# EAGLE design Pure Quantiser (EAGLE 8.7.0)
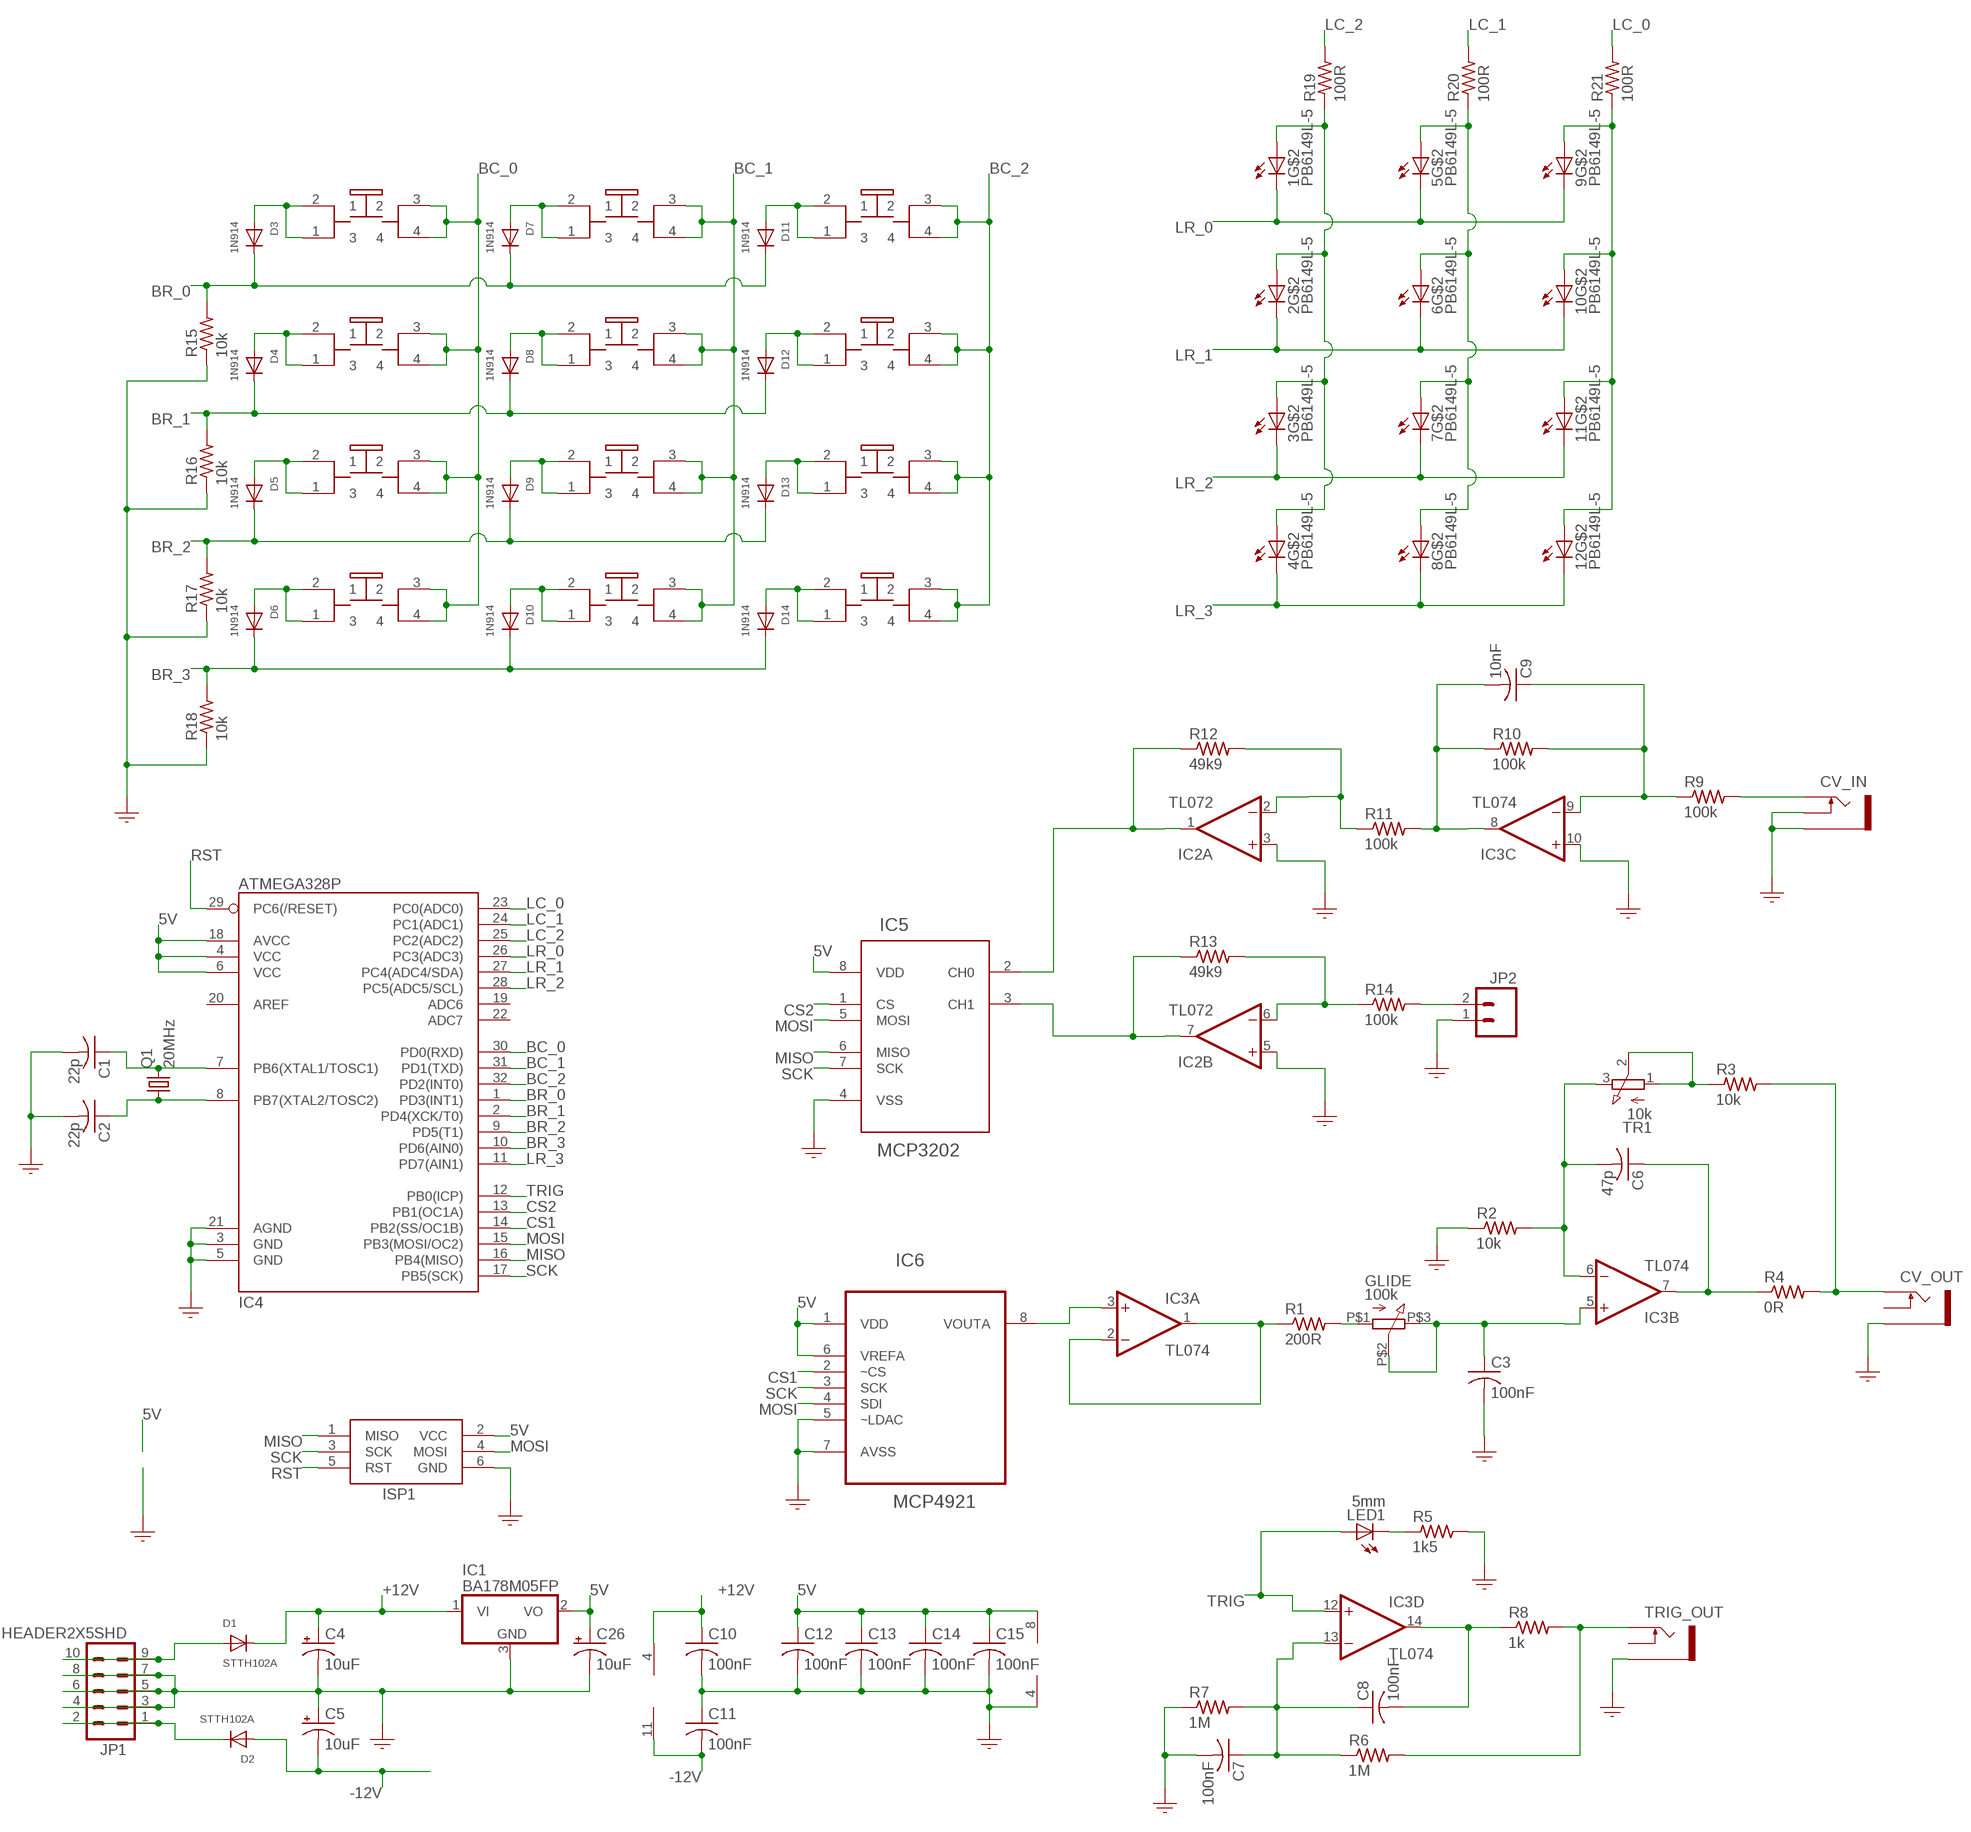
[diagram p0: schematic, sheet 1]

## Parts
1  PB6149L-5  SWITCH_PUSHBUTTON_LED  [PB6149L]
2  PB6149L-5  SWITCH_PUSHBUTTON_LED  [PB6149L]
3  PB6149L-5  SWITCH_PUSHBUTTON_LED  [PB6149L]
4  PB6149L-5  SWITCH_PUSHBUTTON_LED  [PB6149L]
5  PB6149L-5  SWITCH_PUSHBUTTON_LED  [PB6149L]
6  PB6149L-5  SWITCH_PUSHBUTTON_LED  [PB6149L]
7  PB6149L-5  SWITCH_PUSHBUTTON_LED  [PB6149L]
8  PB6149L-5  SWITCH_PUSHBUTTON_LED  [PB6149L]
9  PB6149L-5  SWITCH_PUSHBUTTON_LED  [PB6149L]
10  PB6149L-5  SWITCH_PUSHBUTTON_LED  [PB6149L]
11  PB6149L-5  SWITCH_PUSHBUTTON_LED  [PB6149L]
12  PB6149L-5  SWITCH_PUSHBUTTON_LED  [PB6149L]
C1  22p  CAPACITOR-USC0805  [C0805]
C2  22p  CAPACITOR-USC0805  [C0805]
C3  100nF  CAPACITOR-USC0805  [C0805]
C4  10uF  CAPACITOR_POL-US153CLV-0505  [153CLV-0505]
C5  10uF  CAPACITOR_POL-US153CLV-0505  [153CLV-0505]
C6  47p  CAPACITOR-USC0805  [C0805]
C7  100nF  CAPACITOR-USC0805  [C0805]
C8  100nF  CAPACITOR-USC0805  [C0805]
C9  10nF  CAPACITOR-USC0805  [C0805]
C10  100nF  CAPACITOR-USC0805  [C0805]
C11  100nF  CAPACITOR-USC0805  [C0805]
C12  100nF  CAPACITOR-USC0805  [C0805]
C13  100nF  CAPACITOR-USC0805  [C0805]
C14  100nF  CAPACITOR-USC0805  [C0805]
C15  100nF  CAPACITOR-USC0805  [C0805]
C26  10uF  CAPACITOR_POL-US153CLV-0505  [153CLV-0505]
CV_IN  PJ301M-12  SOCKET_MONO_3.5MMPJ301M-12  [PJ301M-12]
CV_OUT  PJ301M-12  SOCKET_MONO_3.5MMPJ301M-12  [PJ301M-12]
D1  STTH102A  DIODESMA  [SMADIODE]
D2  STTH102A  DIODESMA  [SMADIODE]
D3  1N914  DIODEDO-41  [DO-41]
D4  1N914  DIODEDO-41  [DO-41]
D5  1N914  DIODEDO-41  [DO-41]
D6  1N914  DIODEDO-41  [DO-41]
D7  1N914  DIODEDO-41  [DO-41]
D8  1N914  DIODEDO-41  [DO-41]
D9  1N914  DIODEDO-41  [DO-41]
D10  1N914  DIODEDO-41  [DO-41]
D11  1N914  DIODEDO-41  [DO-41]
D12  1N914  DIODEDO-41  [DO-41]
D13  1N914  DIODEDO-41  [DO-41]
D14  1N914  DIODEDO-41  [DO-41]
GLIDE  100k  RESISTOR_VARIABLE9MM_POT  [POTENTIOMETER_9MM]
IC1  BA178M05FP  VOLTAGE_REG_POS05DT  [TO252]
IC2  TL072  OPAMP_DUALD  [SO08]
IC3  TL074  OPAMP_QUADD  [SO14]
IC4  ATMEGA328P  MICROPROCESSOR_ATMEGA328_SMT  [TQFP32-08]
IC5  MCP3202  ADC_DUAL_12B_MCP3202  [SOIC--8]
IC6  MCP4921  DAC_SINGLE_12B_MCP4921  [SOIC8]
ISP1  HEADER2X3-6  [AVRISP]
JP1  HEADER2X5SHD  [2X5-SHROUDED]
JP2  HEADER1X2PTH  [1X02]
LED1  5mm  LED5MM  [LED5MM]
Q1  20MHz  CRYSTALHC49UP  [HC49UP]
R1  200R  RESISTOR_USR0805  [R0805]
R2  10k  RESISTOR_USR0805  [R0805]
R3  10k  RESISTOR_USR0805  [R0805]
R4  0R  RESISTOR_USR0805  [R0805]
R5  1k5  RESISTOR_USR0805  [R0805]
R6  1M  RESISTOR_USR0805  [R0805]
R7  1M  RESISTOR_USR0805  [R0805]
R8  1k  RESISTOR_USR0805  [R0805]
R9  100k  RESISTOR_USR0805  [R0805]
R10  100k  RESISTOR_USR0805  [R0805]
R11  100k  RESISTOR_USR0805  [R0805]
R12  49k9  RESISTOR_USR0805  [R0805]
R13  49k9  RESISTOR_USR0805  [R0805]
R14  100k  RESISTOR_USR0805  [R0805]
R15  10k  RESISTOR_USR0805  [R0805]
R16  10k  RESISTOR_USR0805  [R0805]
R17  10k  RESISTOR_USR0805  [R0805]
R18  10k  RESISTOR_USR0805  [R0805]
R19  100R  RESISTOR_USR0805  [R0805]
R20  100R  RESISTOR_USR0805  [R0805]
R21  100R  RESISTOR_USR0805  [R0805]
TR1  10k  RESISTOR_VARIABLETRIMMER_TH  [TRIMMER_TH]
TRIG_OUT  PJ301M-12  SOCKET_MONO_3.5MMPJ301M-12  [PJ301M-12]

## Nets
5V: C12.1 C13.1 C14.1 C15.1 C26.+ IC1.2(VO) IC2.8(P:V+) IC4.4(VCC) IC4.6(VCC) IC4.18(AVCC) IC5.8(VDD) IC6.1(VDD) IC6.6(VREFA) ISP1.2(VCC)
+12V: C4.+ C10.1 D1.C IC1.1(VI) IC3.4(P:V+)
-12V: C5.- C11.2 D2.A IC3.11(P:V-)
BC_0: 1.3 1.4 2.3 2.4 3.3 3.4 4.3 4.4 IC4.30(PD0(RXD))
BC_1: 5.3 5.4 6.3 6.4 7.3 7.4 8.3 8.4 IC4.31(PD1(TXD))
BC_2: 9.3 9.4 10.3 10.4 11.3 11.4 12.3 12.4 IC4.32(PD2(INT0))
BR_0: D3.C D7.C D11.C IC4.1(PD3(INT1)) R15.2
BR_1: D4.C D8.C D12.C IC4.2(PD4(XCK/T0)) R16.2
BR_2: D5.C D9.C D13.C IC4.9(PD5(T1)) R17.2
BR_3: D6.C D10.C D14.C IC4.10(PD6(AIN0)) R18.2
CS1: IC4.14(PB2(SS/OC1B)) IC6.2(~CS)
CS2: IC4.13(PB1(OC1A)) IC5.1(CS)
GND: C1.2 C2.2 C3.2 C4.- C5.+ C7.2 C10.2 C11.1 C12.2 C13.2 C14.2 C15.2 C26.- CV_IN.GND(SLEEVE) CV_IN.NORM(SWITCH) CV_OUT.GND(SLEEVE) IC1.3(GND) IC2.3(A:+IN) IC2.4(P:V-) IC2.5(B:+IN) IC3.10(C:+IN) IC4.3(GND) IC4.5(GND) IC4.21(AGND) IC5.4(VSS) IC6.5(~LDAC) IC6.7(AVSS) ISP1.6(GND) JP1.3 JP1.4 JP1.5 JP1.6 JP1.7 JP1.8 JP2.1 R2.1 R5.2 R7.1 R15.1 R16.1 R17.1 R18.1 TRIG_OUT.GND(SLEEVE)
LC_0: IC4.23(PC0(ADC0)) R21.2
LC_1: IC4.24(PC1(ADC1)) R20.2
LC_2: IC4.25(PC2(ADC2)) R19.2
LR_0: 1.K(C) 5.K(C) 9.K(C) IC4.26(PC3(ADC3))
LR_1: 2.K(C) 6.K(C) 10.K(C) IC4.27(PC4(ADC4/SDA))
LR_2: 3.K(C) 7.K(C) 11.K(C) IC4.28(PC5(ADC5/SCL))
LR_3: 4.K(C) 8.K(C) 12.K(C) IC4.11(PD7(AIN1))
MISO: IC4.16(PB4(MISO)) IC5.6(MISO) ISP1.1(MISO)
MOSI: IC4.15(PB3(MOSI/OC2)) IC5.5(MOSI) IC6.4(SDI) ISP1.4(MOSI)
N$1: C1.1 IC4.7(PB6(XTAL1/TOSC1)) Q1.2
N$2: C2.1 IC4.8(PB7(XTAL2/TOSC2)) Q1.1
N$3: IC3.3(A:+IN) IC6.8(VOUTA)
N$4: IC3.1(A:OUT) IC3.2(A:-IN) R1.1
N$5: GLIDE.P$1 R1.2
N$6: C3.1 GLIDE.P$2 GLIDE.P$3 IC3.5(B:+IN)
N$7: R3.1 TR1.1 TR1.2
N$8: CV_OUT.TIP R3.2 R4.2
N$9: D1.A JP1.9 JP1.10
N$10: D2.C JP1.1 JP1.2
N$11: C6.1 IC3.7(B:OUT) R4.1
N$12: C6.2 IC3.6(B:-IN) R2.2 TR1.3
N$13: C7.1 C8.1 IC3.13(D:-IN) R6.1 R7.2
N$14: LED1.K(C) R5.1
N$15: R6.2 R8.2 TRIG_OUT.TIP
N$16: C8.2 IC3.14(D:OUT) R8.1
N$17: C9.1 IC3.9(C:-IN) R9.1 R10.2
N$18: CV_IN.TIP R9.2
N$19: IC2.1(A:OUT) IC5.2(CH0) R12.1
N$20: IC2.2(A:-IN) R11.1 R12.2
N$21: C9.2 IC3.8(C:OUT) R10.1 R11.2
N$22: 1.1 1.2 D3.A
N$23: IC2.7(B:OUT) IC5.3(CH1) R13.1
N$24: IC2.6(B:-IN) R13.2 R14.1
N$25: JP2.2 R14.2
N$26: 2.1 2.2 D4.A
N$27: 3.1 3.2 D5.A
N$28: 4.1 4.2 D6.A
N$29: 5.1 5.2 D7.A
N$30: 6.1 6.2 D8.A
N$31: 7.1 7.2 D9.A
N$32: 8.1 8.2 D10.A
N$33: 9.1 9.2 D11.A
N$34: 10.1 10.2 D12.A
N$35: 11.1 11.2 D13.A
N$36: 12.1 12.2 D14.A
N$37: 1.A 2.A 3.A 4.A R19.1
N$38: 5.A 6.A 7.A 8.A R20.1
N$39: 9.A 10.A 11.A 12.A R21.1
RST: IC4.29(PC6(/RESET)) ISP1.5(RST)
SCK: IC4.17(PB5(SCK)) IC5.7(SCK) IC6.3(SCK) ISP1.3(SCK)
TRIG: IC3.12(D:+IN) IC4.12(PB0(ICP)) LED1.A
Unconnected: CV_OUT.NORM(SWITCH) IC4.19(ADC6) IC4.20(AREF) IC4.22(ADC7) TRIG_OUT.NORM(SWITCH)

## Library data of the parts
1-12 = GMSN:SWITCH_PUSHBUTTON_LED: Pushbutton LED; SORT: 9
C1-C3 C6-C15 = GMSN:CAPACITOR-US: Capacitor; SORT: 3
C4 C5 C26 = GMSN:CAPACITOR_POL-US: Electro Capacitor; SORT: 6
CV_IN CV_OUT TRIG_OUT = GMSN:SOCKET_MONO_3.5MM: 3.5 mm Jack Socket; SORT: 8
D1-D14 = GMSN:DIODE: Diode SMADIODE - SMA Surface Mount Package 20V 1A Schottky Diode Digikey: 641-1014-6-ND DO-1N4148 - Through Hole Small Current Diode SOD-123 20V 1 A (.5mV Vf) Schottky Diode - Digikey: MBRX120TPMSCT-ND SOD-323 10V 570mA (.38mV Vf, 3ns) Schottky Diode - Digikey: ZLLS410CT-ND SOD-523 30V 30mA Schottky Diode (RB751S-40TE61) - Digikey: RB751S-40TE61CT-ND SOT23-R/W - SOT23 Package (R = Solder Paste/Reflow Ovens, W = Hand-Soldering) BAT54Film 40V 300mA - Digikey: 497-7162-1-ND; SORT: 1
GLIDE = GMSN:RESISTOR_VARIABLE: Potentiometer; SORT: 8
IC1 = GMSN:VOLTAGE_REG_POS: Positive Voltage Regulator Added bigger pads to the TO-92 package; SORT: 4
IC2 = GMSN:OPAMP_DUAL: OP AMP; SORT: 4
IC3 = GMSN:OPAMP_QUAD: OP AMP; SORT: 4
IC4 = GMSN:MICROPROCESSOR_ATMEGA328_SMT: 32-Pin ATMEGA328 Commonly used on Arduino compatible boards Available in QFP and QFN packages TQFP is IC-09069 QFN is non-stock; SORT: 4
IC5 = GMSN:ADC_DUAL_12B_MCP3202: 12bit 2Ch ADC; SORT: 4
IC6 = GMSN:DAC_SINGLE_12B_MCP4921: 12bit DAC; SORT: 4
ISP1 = GMSN:HEADER2X3: AVR ISP Header Standard 6 pin header for AVR programming; SORT: 7
JP1 = GMSN:HEADER2X5: Header 5x2 Standard 10-pin dual row 0.1" header. Commonly used with AVR-ISP. Use with Spark Fun Electronics SKU: PRT-00778; SORT: 7
JP2 = GMSN:HEADER1X2: Header 1x2; SORT: 7
LED1 = GMSN:LED: LED OSRAM: - CHIPLED LG R971, LG N971, LY N971, LG Q971, LY Q971, LO R971, LY R971 LH N974, LH R974 LS Q976, LO Q976, LY Q976 LO Q996 - Hyper CHIPLED LW Q18S LB Q993, LB Q99A, LB R99A - SideLED LS A670, LO A670, LY A670, LG A670, LP A670 LB A673, LV A673, LT A673, LW A673 LH A674 LY A675 LS A676, LA A676, LO A676, LY A676, LW A676 LS A679, LY A679, LG A679 - Hyper Micro SIDELED® LS Y876, LA Y876, LO Y876, LY Y876 LT Y87S - SmartLED LW L88C, LW L88S LB L89C, LB L89S, LG L890 LS L89K, LO L89K, LY L89K LS L896, LA L896, LO L896, LY L896 - TOPLED LS T670, LO T670, LY T670, LG T670, LP T670 LSG T670, LSP T670, LSY T670, LOP T670, LYG T670 LG T671, LOG T671, LSG T671 LB T673, LV T673, LT T673, LW T673 LH T674 LS T676, LA T676, LO T676, LY T676, LB T676, LH T676, LSB T676, LW T676 LB T67C, LV T67C, LT T67C, LS T67K, LO T67K, LY T67K, LW E67C LS E67B, LA E67B, LO E67B, LY E67B, LB E67C, LV E67C, LT E67C LW T67C LS T679, LY T679, LG T679 LS T770, LO T770, LY T770, LG T770, LP T770 LB T773, LV T773, LT T773, LW T773 LH T774 LS E675, LA E675, LY E675, LS T675 LS T776, LA T776, LO T776, LY T776, LB T776 LHGB T686 LT T68C, LB T68C - Hyper Mini TOPLED® LB M676 - Mini TOPLED Santana® LG M470 LS M47K, LO M47K, LY M47K Source: http://www.osram.convergy.de/; SORT: 9
Q1 = GMSN:CRYSTAL: Crystal; SORT: 5
R1-R21 = GMSN:RESISTOR_US: Resistor; SORT: 2
TR1 = GMSN:RESISTOR_VARIABLE: Potentiometer; SORT: 7

## Board
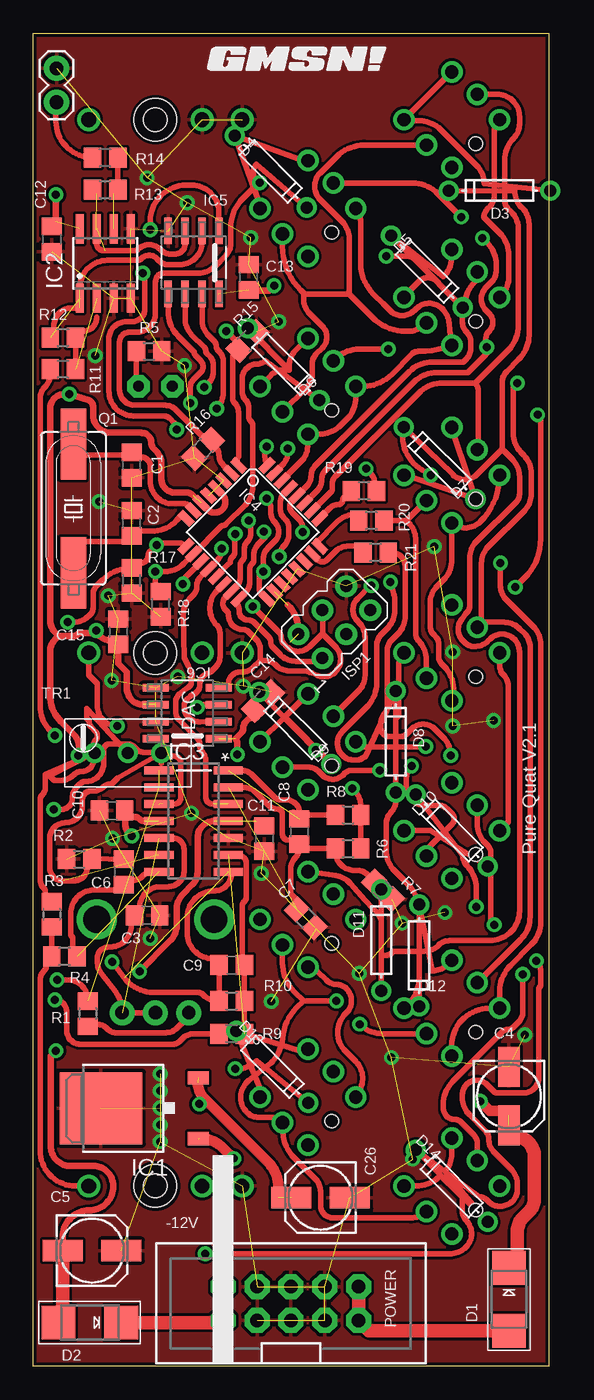
[diagram p1: board, top side]
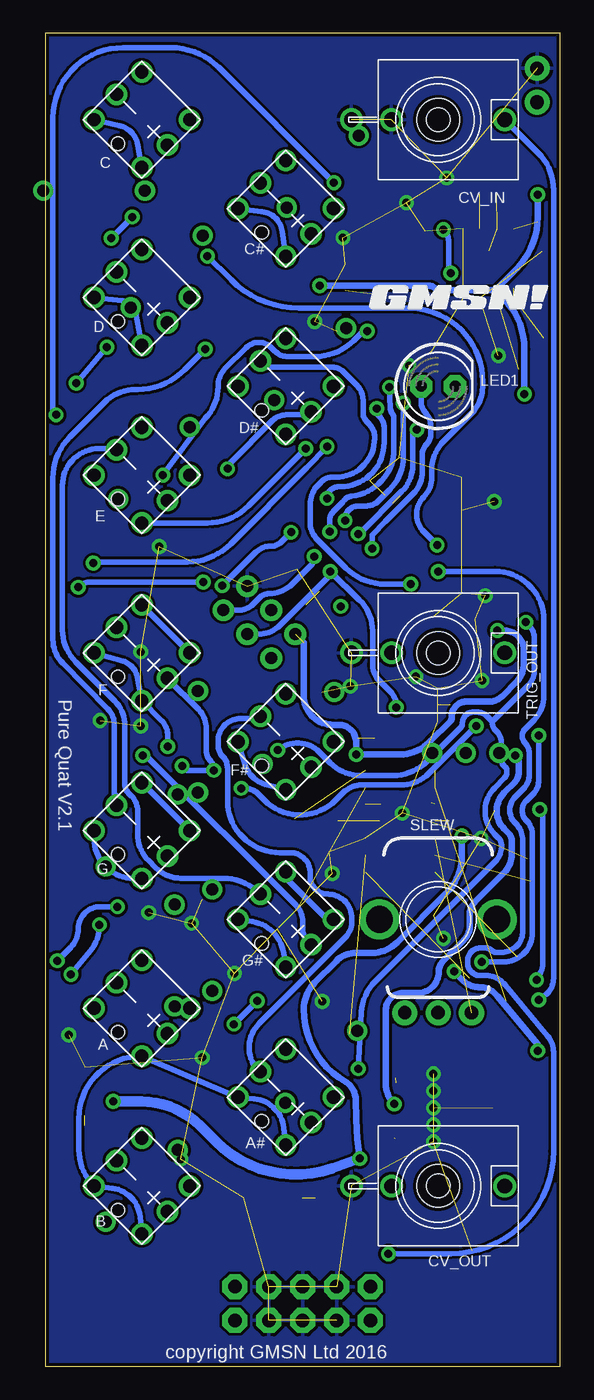
[diagram p2: board, bottom side, seen from below]

Size 38.64 x 100 mm. Coordinates in mm from the lower left corner, seen from the top.
Outline: 38.64,0 0,0 0,100 38.64,100 38.64,0
Copper layers (1*16): Top 0.035mm / dielectric 1.5mm / Bottom 0.035mm
Design rules "SparkFun": minimum track width 8mil, minimum drill 20mil, track to track 8mil, track to pad 8mil, pad to pad 8mil, via to via 8mil, smd to smd 8mil, copper to edge 10mil, drill to drill 8mil, minimum pad ring 12mil, minimum via ring 10mil, stop-mask expansion 4mil, vias tented up to drill 25mil, thermal gap 10mil
Holes 3.2 mm at 9.16,13.52 9.16,53.52 9.16,93.52

### Footprints (pad centres in the part's own frame; a part is rotated, then mirrored left to right if it is on the bottom)
PB6149L = drill 1: 1 2.54,-2.54; 2 2.54,2.54; 3 -2.54,-2.54; 4 -2.54,2.54; A 0,-2.7; K 0,2.7 | hole 1: -2.54,0
C0805 = smd 1.3 x 1.5: 1 -0.95,0; 2 0.95,0
153CLV-0505 = smd 3 x 1.6: + 2.2,0; - -2.2,0
PJ301M-12 = drill 1.1: GND 0,-6.5; NORM 0,-3.5; TIP 0,5 | hole 1.778: 0,0
SMADIODE = smd 2.54 x 2.54: A 2.349,0; C -2.349,0
DO-41 = drill 0.9: A -3.81,0; C 3.81,0
POTENTIOMETER_9MM = drill 1 pad 1.88: P$1 -2.5,-7; P$2 0,-7; P$3 2.5,-7 | drill 2 pad 2.68: P$4 -4.4,0; P$5 4.4,0
TO252 = smd 1 x 1.6: 1 -2.28,-4.8; 2 2.28,-4.8 | smd 5.4 x 6.2: 3 0,2.5
SO08 = smd 0.6 x 2.2: 1 -1.905,-2.6; 2 -0.635,-2.6; 3 0.635,-2.6; 4 1.905,-2.6; 5 1.905,2.6; 6 0.635,2.6; 7 -0.635,2.6; 8 -1.905,2.6
SO14 = smd 0.6 x 2.2: 1 -3.81,-2.6; 2 -2.54,-2.6; 3 -1.27,-2.6; 4 0,-2.6; 5 1.27,-2.6; 6 2.54,-2.6; 7 3.81,-2.6; 8 3.81,2.6; 9 2.54,2.6; 10 1.27,2.6; 11 0,2.6; 12 -1.27,2.6; 13 -2.54,2.6; 14 -3.81,2.6
TQFP32-08 = smd 1.27 x 0.559: 1 -4.293,2.8; 2 -4.293,2; 3 -4.293,1.2; 4 -4.293,0.4; 5 -4.293,-0.4; 6 -4.293,-1.2; 7 -4.293,-2; 8 -4.293,-2.8; 17 4.293,-2.8; 18 4.293,-2; 19 4.293,-1.2; 20 4.293,-0.4; 21 4.293,0.4; 22 4.293,1.2; 23 4.293,2; 24 4.293,2.8 | smd 0.559 x 1.27: 9 -2.8,-4.293; 10 -2,-4.293; 11 -1.2,-4.293; 12 -0.4,-4.293; 13 0.4,-4.293; 14 1.2,-4.293; 15 2,-4.293; 16 2.8,-4.293; 25 2.8,4.293; 26 2,4.293; 27 1.2,4.293; 28 0.4,4.293; 29 -0.4,4.293; 30 -1.2,4.293; 31 -2,4.293; 32 -2.8,4.293
SOIC--8 = smd 1.981 x 0.559: 1 -2.362,1.905; 2 -2.362,0.635; 3 -2.362,-0.635; 4 -2.362,-1.905; 5 2.362,-1.905; 6 2.362,-0.635; 7 2.362,0.635; 8 2.362,1.905
SOIC8 = smd 1.981 x 0.559: 1 -2.362,1.905; 2 -2.362,0.635; 3 -2.362,-0.635; 4 -2.362,-1.905; 5 2.362,-1.905; 6 2.362,-0.635; 7 2.362,0.635; 8 2.362,1.905
AVRISP = drill 0.9 pad 1.626: 1 -1.27,2.54; 2 1.27,2.54; 3 -1.27,0; 4 1.27,0; 5 -1.27,-2.54; 6 1.27,-2.54
2X5-SHROUDED = drill 1.016 pad 1.88 octagon: 1 -1.27,5.08; 2 1.27,5.08; 3 -1.27,2.54; 4 1.27,2.54; 5 -1.27,0; 6 1.27,0; 7 -1.27,-2.54; 8 1.27,-2.54; 9 -1.27,-5.08; 10 1.27,-5.08
1X02 = drill 1.016 pad 1.88: 1 0,0; 2 2.54,0
LED5MM = drill 0.813 pad 1.676 octagon: A -1.27,0; K 1.27,0
HC49UP = smd 5.334 x 1.93: 1 -4.826,0; 2 4.826,0
R0805 = smd 1.3 x 1.5: 1 -0.95,0; 2 0.95,0
TRIMMER_TH = drill 0.9: 1 -0.802,1.143; 2 -3.302,1.143; 3 -5.802,1.143

### Placement (x,y rotation side)
1  31.38,93.52 45 bottom
2  20.59,86.85 45 bottom
3  31.38,80.19 45 bottom
4  20.59,73.52 45 bottom
5  31.38,66.85 45 bottom
6  31.38,53.52 45 bottom
7  20.59,46.85 45 bottom
8  31.38,40.19 45 bottom
9  20.59,33.52 45 bottom
10  31.38,26.85 45 bottom
11  20.59,20.19 45 bottom
12  31.38,13.52 45 bottom
C1  7.37,67.61 270 top
C2  7.37,63.24 90 top
C3  8.53,33.83 0 top
C4  35.67,20.26 270 top
C5  4.4,8.67 0 top
C6  6.78,37.09 90 top
C7  20.43,33.59 315 top
C8  19.95,40.1 90 top
C9  14.88,30.1 180 top
C10  5.91,41.69 180 top
C11  17.34,39.59 90 top
C12  1.38,84.55 270 top
C13  16.14,81.69 90 top
C14  17.22,49.91 45 top
C15  6.38,55.1 90 top
C26  21.54,12.64 180 top
CV_IN  9.16,93.52 270 bottom
CV_OUT  9.16,13.52 270 bottom
D1  35.67,5.02 270 top
D2  4.24,3.27 180 top
D3  34.96,88.21 180 top
D4  17.81,89.63 315 top
D5  29.52,82.13 315 top
D6  18.76,75.19 315 top
D7  30.47,67.76 135 top
D8  27.18,46.85 90 top
D9  19.64,47.89 135 top
D10  31.38,40.19 135 top
D11  26.09,31.95 90 top
D12  28.93,30.82 270 top
D13  17.93,22.45 315 top
D14  31.38,13.52 135 top
GLIDE  9.16,33.52 0 bottom
IC1  7.57,19.35 90 top
IC2  5.39,82.73 0 top
IC3  12.02,40.9 270 top
IC4  16.46,62.57 315 top
IC5  12.02,82.81 270 top
IC6  11.54,48.99 180 top
ISP1  22.57,55.82 135 top
JP1  19.32,4.7 90 top
JP2  1.74,97.37 270 top
LED1  9.16,73.52 0 bottom
Q1  3.01,64.35 90 top
R1  4.08,26.45 270 top
R2  3.45,38.04 0 top
R3  1.38,33.91 270 top
R4  2.33,30.74 180 top
R5  8.68,76.14 0 top
R6  23.61,38.83 0 top
R7  26.23,35.7 135 top
R8  23.61,41.37 0 top
R9  14.88,24.94 180 top
R10  14.88,27.4 0 top
R11  2.21,74.79 180 top
R12  2.21,77.17 0 top
R13  5.39,88.28 0 top
R14  5.39,90.66 180 top
R15  16.07,76.93 225 top
R16  12.73,68.84 45 top
R17  7.37,58.95 90 top
R18  9.56,57.17 90 top
R19  24.8,65.66 180 top
R20  25.35,63.44 180 top
R21  25.67,61.06 180 top
TR1  3.79,47.15 180 top
TRIG_OUT  9.16,53.52 270 bottom
U$1  [GMSN!_LOGO]  7.33,80.11 0 bottom
U$2  [GMSN!_LOGO]  20.03,98.01 0 top

### Tracks (layer width: path | path; a pad name or v marks a point on that pad's centre or on a via)
5V  (via drill 0.6)  (9 unrouted)
  Top 0.5: IC4.6 13.07,64.26 arc45 13.61,64.03 arc90 14.4,64.82 arc45 14.14,65.44 IC4.4 | 19.08,57.12 arc-45 19.88,55.18 ISP1.2 | C14.1 16.75,48.67 16.59,48.67 arc90 15.75,47.84 arc-45 15.61,47.5 15.19,47.09 15.23,47 arc-22 15.31,46.59 v15.31,45.9 | 8.25,49.63 arc-90 7.02,50.86 7.02,52.09 6.35,52.71 C15.1 5.98,54.43 5.96,54.43 arc-45 4.79,54.91 4.67,55.02 | C13.1 16.78,80.69 | 16.78,80.69 17.68,80.69 v18.05,81.06 | v1.7,87.89 1.7,85.87 C12.1 1.61,85.33 | 16.53,80.44 16.78,80.69 | 12,65.33 arc45 11.49,65.54 10.64,65.54 arc-90 9.6,66.59 9.6,67.71 arc45 9.2,68.68 9.03,68.85 arc-45 8.84,69.3 arc90 8.11,70.03 5.87,70.03 arc-90 4.48,71.42 4.48,72.02 arc73 4.14,72.47 v2.69,72.92 2.33,72.92 arc90 1.26,71.86 1.26,55.97 arc45 1.65,55.03 1.9,54.79 | 1.9,54.79 3.02,54.79 arc45 3.34,54.92 arc-45 3.6,55.02 4.67,55.02 | 1.9,54.79 1.66,54.55 arc45 1.26,53.59 1.26,50.33 arc45 2.09,48.32 3.05,47.36 arc-45 3.45,46.42 3.45,45.86 v3.37,45.82 | v4.71,55.18 4.67,55.02 | v12.45,19.66 12.77,19.98 12.81,20.1
  Top 0.8: 12.33,21.25 arc45 12.81,20.1 17.6,15.31 arc-45 18.37,13.46 18.37,12.64
  Bottom 0.5: v18.05,81.06 9.85,81.06 arc45 9.35,80.85 arc-45 9.08,80.74 4.87,80.74 | v2.69,72.92 2.69,76.3 arc-45 4.29,80.16 4.87,80.74 | v1.7,87.89 1.7,86.19 arc45 3.3,82.31 4.87,80.74 | v3.37,45.82 3.13,45.38 3.13,44.54 arc45 3.43,43.81 4.21,43.03 arc-90 4.21,40.31 3.89,39.99 arc45 3.64,39.4 3.64,38.4 arc45 4.21,37.04 6.39,34.85 arc-45 6.78,33.92 6.78,33.13 arc45 7.29,31.89 8.77,30.41 arc-45 9.12,29.57 arc90 10.69,28 11.79,28 arc-90 13.09,26.7 13.09,21.2 arc-45 v12.45,19.66 | v4.71,55.18 4.2,55.18 arc90 2.73,53.71 2.73,52.7 arc45 3.3,51.32 4.33,50.29 arc45 5.35,49.87 7.05,49.87 arc-90 8.13,48.79 8.13,48.66 arc45 8.23,48.41 9.82,46.82 arc45 12.06,45.9 v15.31,45.9 15.31,46.82 arc-90 16.61,48.12 17.05,48.12 arc90 19.24,50.31 19.24,54.28
+12V  (via drill 0.6)  (3 unrouted)
  Top 0.4: 35.67,18.83 35.35,19.15
  Top 0.5: 8.33,40.9 arc-45 7.99,41.04 arc45 7.56,41.21 7.38,41.21 C10.1 6.91,40.6 arc60 v7.37,39.78
  Top 0.8: 35.35,19.15 34.24,19.15 v33.53,19.86 | v15.03,15.58 14.25,16.36 arc45 12.45,17.11
  Top 1.016: D1.C 35.72,7.37 36.31,7.96 36.31,10.14 arc-45 36.73,11.15 37.2,11.62 arc45 37.58,12.54 37.58,15.74 arc90 36.08,17.24 35.75,17.24 35.75,17.98 C4.+
  Bottom 0.5: v7.37,39.78 7.37,38.35 arc45 8.57,35.45 12.24,31.79 arc45 14.1,31.01 15.29,31.01 arc-45 16.82,30.38 18.4,28.8 arc-45 19.24,26.76 arc-60 16.11,21.33 arc60 15.35,20.02 arc-8 v15.03,15.58
  Bottom 0.8: v33.53,19.86 31.44,19.86 arc45 27.01,18.03 25.84,16.86 arc-64 17.11,14.86 v15.03,15.58
-12V  (via drill 0.6)  (2 unrouted)
  Top 0.5: C5.- 2.2,9.7 arc-90 4.19,11.69 arc90 5.99,13.48 5.99,13.54 arc90 4.51,15.02 2.79,15.02 arc-90 1.3,16.51 1.3,23.28 v1.7,23.67 | v7.97,29.62 10.27,31.93 arc45 10.75,33.08 10.75,34.25 arc-45 11.24,35.43 11.9,36.09 arc45 12.34,37.15 12.34,39.68 arc-90 13.55,40.9 | 16.7,40.9 17.34,40.26 C11.2
  Top 1.016: D2.A 2.2,3.58 C5.-
  Bottom 0.5: v1.7,23.67 1.7,24.15 4.72,27.79 arc-50 6.1,28.43 arc45 7.26,28.92 v7.97,29.62
BC_0
  Top 0.4: 26.23,79.71 26.75,79.18 arc90 28.56,79.18 28.72,79.34 arc-82 30.51,79.47 arc-49 31.19,78.24 arc5 3.3 arc-21 28.87,76.14 arc45 28.42,75.95 26.88,74.41 arc-45 24.73,73.52 4.4 24.18,72.7 arc-45 23.49,71.02 23.06,70.59 arc-45 21.46,69.93 4.3 20.59,69.14 arc-45 20.06,67.86 IC4.30 | 34.98,85.01 33.8,86.19 arc-45 34.06,86.83 34.27,87.04 arc45 34.56,87.74 34.56,92.51 arc-45 1.4
  Top 0.406: 34.98,85.01 arc-45 35.67,83.33 35.67,81.77 arc-45 35.04,80.25 3.4 | 26.23,79.71 25.5,80.44 arc-45 24.56,82.7 24.56,85.77 arc45 24.18,86.67 2.4
  Bottom 0.4: 1.3 31.69,91.62 arc-67 33.08,93.08 1.4 | 2.3 20.84,85.1 arc-75 22.38,86.63 2.4 | 3.4 32.85,79.93 arc72 31.86,79.01 3.3
BC_1  (via drill 0.6)
  Top 0.4: IC4.31 18.68,67.61 arc54 v19.08,68.84 | 34.88,53.52 6.4 34.98,52.56 arc45 35.27,51.85 arc-45 35.63,50.98 35.63,40.84 8.4 | 7.4 arc45 25.15,46.45 29.4,46.45 v29.44,46.49 | 33.54,63.37 arc-84 5.3 31.38,60.5 arc-45 30.77,59.01 30.3,58.54 arc45 29.76,57.23 29.76,55.56 arc45 30.05,54.85 30.21,54.69 arc-45 30.39,54.26 30.39,53.28 arc45 30.65,52.67 30.8,52.52 arc-64 6.3
  Top 0.406: 33.54,63.37 arc45 34.96,66.8 34.96,66.83 5.4
  Bottom 0.4: v19.08,68.84 23.36,64.55 arc45 26.48,63.26 5.3 | 6.4 32.82,52.91 arc63 31.72,51.71 6.3 29.91,48.45 arc45 29.44,47.32 v29.44,46.49 | 7.3 22.11,43.66 arc58 23.61,45.07 7.4 | 8.3 31.95,36.59 arc90 34.98,39.62 8.4
BC_2  (via drill 0.6)
  Top 0.4: 10.4 34.19,26.85 arc90 31.38,24.05 10.3 | 9.3 arc-45 21.29,29.64 21.96,28.97 arc45 22.77,28.63 arc-45 23.45,28.35 23.48,28.32 arc-90 23.48,26.51 23.42,26.45 arc90 23.42,23.62 24.18,22.86 arc-90 24.18,20.36 11.4
  Top 0.406: IC4.32 17.45,67.79 arc-40 v17.49,68.99 | 10.4 34.98,28.13 arc-45 35.77,30.04 37.36,31.63 arc45 38.05,33.3 38.05,54.16 arc45 37.5,55.5 35.41,57.59 arc-45 35.04,58.49 v35.04,60.26
  Bottom 0.4: 9.3 20.75,31.01 arc-73 23.1,33.35 9.4 | 11.3 20.73,17.87 arc-78 22.94,20.06 11.4 10.3 31.45,23.26 arc-90 36.11,18.6 36.11,16.25 arc-45 12.4 33.62,13.35 arc77 31.51,11.2 12.3
  Bottom 0.406: v17.49,68.99 19,67.41 24.73,61.68 arc45 27.96,60.34 34.96,60.34 v35.04,60.26
BR_0  (via drill 0.6)
  Top 0.4: D3.C 36.11,88.14 arc45 36.6,86.96 36.69,86.87 arc-45 37.18,85.69 37.18,77.37 arc-45 36.42,75.54 35.49,74.61 arc45 35.16,73.8 35.16,68.8 | IC4.1 15.11,67.88 15.31,68 15.39,68.24 15.39,71.55 arc45 15.09,72.27 15.09,72.27 arc-45 14.95,72.6 14.95,75.82 | 35.16,68.8 35.94,68.01 arc-45 36.47,66.74 36.47,65.42 | 36.47,36.77 36.47,53.57 arc45 36.05,54.56 arc90 34.26,54.56 34.13,54.44 arc-45 33.06,53.99 arc-45 32.37,54.28 32.24,54.4 arc-90 32.2,56.12 arc-15 32.54,56.57 arc44 32.73,57.05 32.73,60.68 | v29.8,66.85 29.9,66.95 arc-90 D7.C 31.41,66.95 31.48,66.87 arc90 33.23,66.87 35.16,68.8 | 28.7,31.13 27.15,31.13 arc45 26.93,31.04 26.89,31.01 arc-45 26.43,30.82 26.11,30.82 D11.C
  Top 0.406: 32.73,60.68 arc-45 33.22,61.86 36.24,64.88 arc45 36.47,65.42 | v14.48,77.65 15.39,76.73 R15.2 14.95,75.82 | 28.7,31.13 29.3,31.13 arc45 30.42,31.6 arc-45 31.22,31.93 34.23,31.93 arc90 36.47,34.17 36.47,36.77
  Bottom 0.406: v14.48,77.65 14.8,77.65 15.48,76.96 arc45 18.43,75.74 20.4,75.74 arc45 21.4,76.16 21.66,76.42 arc-90 23.57,76.42 25.11,74.87 arc-45 25.67,73.53 25.67,73.47 arc45 26.64,71.12 v29.8,66.85
BR_1  (via drill 0.6)
  Top 0.4: R16.2 13.09,69.28 | R16.2 13.28,69.63 12.81,69.63 10.67,71.77 arc45 9.9,72.09 7.62,72.09 arc-90 6.46,73.25 6.46,76.84 arc-90 7.19,77.57 7.7,77.57 arc90 9.16,79.03 9.16,81.35 arc-90 9.82,82.01 12.37,82.01 arc45 13.66,82.55 14.41,83.29 arc45 14.8,84.23 14.8,85.42 arc-45 15.7,87.6 16.9,88.8 v16.98,88.8 16.94,88.8 16.73,89 arc-90 16.73,90.18 D4.C | IC4.2 14.26,67.6 arc-45 13.92,68.4 13.92,68.41 arc45 13.73,68.87 13.4,69.2 R16.2 | D8.C 24.88,45.7 arc45 24.67,45.61 arc-45 24.4,45.5 23.87,45.5 arc-45 23.28,45.74 23.17,45.86 arc-90 23.17,47.6 24.98,49.41 arc45 25.75,51.27 25.75,54.04 arc-45 26.11,54.91 26.53,55.33 arc45 27.1,56.7 27.1,57.53 arc45 26.63,58.67 arc-135 26.69,58.83 v26.78,58.83 | v37.81,71.38 arc-45 38.05,70.8 38.05,62.06 arc-45 36.84,59.13 v36.15,58.44
  Top 0.406: D8.C 27.18,42.33 arc-45 26.89,41.64 26.88,41.63 arc45 26.46,40.62 26.46,38.69 arc45 27.09,37.17 28.04,36.22 arc-45 28.93,34.08 D12.C
  Bottom 0.4: v16.98,88.8 25.62,97.44 arc-45 29.19,98.92 32.8,98.92 arc-90 38.05,93.66 38.05,71.61 v37.81,71.38 | v36.15,58.44 arc45 35.19,58.83 v26.78,58.83
BR_2  (via drill 0.6)
  Top 0.4: v2.57,55.82 3.03,55.82 arc45 4.15,56.28 4.3,56.44 arc45 4.48,56.86 4.48,57.92 arc-45 4.73,58.54 5.17,58.97 arc-45 7.34,59.87 R17.2 7.53,59.9 7.89,60.26 8.08,60.26 arc90 8.6,60.79 arc-45 8.74,61.11 v9.24,61.61 arc-45 9.62,61.77 10.82,61.77 arc-45 IC4.9 | D9.C v21.18,46.21 | D13.C 16.76,22.9 arc-45 15.36,22.32 v15.15,22.32
  Top 0.406: D5.C 28.61,83.04 arc45 28.03,83.28 v26.46,83.28
  Bottom 0.4: 5.11,48.36 5.4,48.69 arc-48 6.26,49.07 6.54,49.07 arc-90 7.33,48.28 arc45 7.5,47.87 10,45.37 arc45 12.56,44.31 14.97,44.31 arc45 17.25,45.25 18.07,46.07 arc-85 v21.18,46.21 | 5.11,48.36 2.46,51.01 arc-45 1.94,52.27 1.94,54.53 arc-45 2.4,55.64 v2.57,55.82 | v26.46,83.28 24.69,81.51 arc-45 19.58,79.39 11.45,79.39 arc45 7.41,77.72 arc45 5.83,73.9 5.83,73.47 | 5.11,48.36 arc-45 4.83,47.68 4.73,47.58 arc45 4.44,46.88 4.44,45.58 arc-45 4.21,45.04 4.11,44.94 arc45 4,44.67 4,44.57 arc45 4.19,44.12 4.92,43.39 arc-90 4.92,39.91 4.64,39.63 arc45 4.4,39.04 arc45 4.88,37.87 13.87,28.88 arc-42 14.91,26.56 v15.15,22.32
  Bottom 0.406: 5.83,73.47 arc45 6.63,71.52 8.75,69.4 arc-45 9.64,67.27 9.64,66.68 arc45 10.24,65.21 arc-90 10.24,62.62 v9.24,61.61
BR_3  (via drill 0.6)
  Top 0.4: D6.C 17.4,75.45 arc-45 16.77,75.19 arc90 15.67,74.09 15.67,73.14 arc45 15.96,72.44 arc-45 16.14,71.99 16.14,71.33 arc45 16.34,70.86 arc-45 16.46,70.57 16.46,66.02 arc-45 15.88,64.6 14.44,63.16 arc-45 14.24,63.08 arc45 14.08,63.02 IC4.10 11.27,60.2 arc-45 9.89,59.63 v9.16,59.63 9.16,58.52 R18.2 | v12.89,8.43 31.22,8.43 arc45 32.45,8.94 arc90 32.45,10.94 arc-45 32.18,11.59 32.18,12.69 D14.C | 34.16,17.08 arc45 33.94,17.63 32.72,18.84 arc-45 32.18,20.16 32.18,20.34 arc-45 32.51,21.15 arc-90 33.99,21.15 34.52,20.62 arc45 34.81,20.5 36.76,20.5 arc90 37.89,21.63 37.89,28.24
  Top 0.406: D14.C 33.45,12.71 arc-45 34.01,12.47 34.16,12.32 arc45 34.93,12 35.04,12 arc90 36.31,13.27 36.31,13.6 arc45 35.8,14.81 34.57,16.04 arc-45 34.16,17.02 34.16,17.08 | 37.89,28.24 arc-45 37.98,28.44 arc45 38.05,28.62 38.05,29.65 arc45 v37.73,30.42 | v33.21,34.47 33.21,35.89 arc45 32.53,37.53 arc-45 32.2,38.33 D10.C
  Bottom 0.4: v9.16,59.63 4.9,59.63 arc90 1.22,55.95 1.22,50.27 arc45 1.96,48.49 2.63,47.82 arc-90 2.63,46.75 arc45 2.33,46.03 2.33,44.34 arc45 2.75,43.34 3.4,42.68 arc-90 3.4,40.78 3.35,40.72 arc45 2.81,39.42 2.81,32.65 arc90 4.41,31.05 4.82,31.05 arc45 5.19,31.21 arc-45 5.58,31.37 6.01,31.37 arc-90 6.94,30.44 6.94,30.18 arc-45 6.71,29.64 6.62,29.55 arc-45 6.04,29.31 5.62,29.31 arc50 4.14,28.61 0.94,24.75 arc40 0.51,23.55 0.51,16.15 arc90 8.23,8.43 v12.89,8.43
  Bottom 0.406: v37.73,30.42 36.73,31.42 arc-45 36.15,32.83 arc90 34.51,34.47 v33.21,34.47
CS1
  Top 0.4: 13.29,52.09 12.96,51.94 arc51 12.52,51.39 12.51,51.34 arc14 12.49,51.24 12.49,51.12 arc-35 12.36,50.71 12.29,50.6 arc-31 12.1,50.45 11.94,50.38 arc19 11.79,50.28 11.55,50.06 arc47 11.3,49.48 arc45 11.62,48.71 arc43 12.5,48.33
  Top 0.406: IC4.14 13.78,58.18 arc90 13.78,55.57 arc-45 14,55.02 14,53.21 arc-45 13.71,52.51 13.29,52.09 | 12.5,48.33 IC6.2
CS2  (via drill 0.6)
  Top 0.4: v10.75,70.27 arc45 10.52,70.81 10.25,71.08 arc45 9.72,71.3 7.52,71.3 arc-90 5.67,73.15 5.67,77.07 arc-90 6.96,78.36 7.4,78.36 arc90 8.37,79.33 8.37,82.01 v8.21,82.01 | v8.76,85.27 8.76,85.91 arc-90 11.45,88.6 11.87,88.6 arc-90 13.92,86.55 IC5.1 | IC4.13 14.74,60.28 arc45 14.76,60.32 arc-45 14.91,60.7 14.97,60.75 arc45 15.11,61.11 15.11,62.41 v15.15,62.45
  Bottom 0.4: v10.75,70.27 11.06,69.95 11.06,67.61 arc45 11.88,65.64 15.07,62.45 v15.15,62.45 | v8.21,82.01 8.37,82.01 8.37,84.31 arc-45 v8.76,85.27
GND  (via drill 0.6)  (73 unrouted)
  Top 0.5: C7.2 21.23,32.8
  other vias: 28.45,15.54 36.86,24.86 9.52,19.39 9.52,20.66 9.52,21.93 9.52,18.12 9.52,16.85 17.85,27.36 8.76,32.09 27.65,33.24 24.44,29.47 17.1,36.97 30.87,34.03 5.95,39.59 11.86,41.49 5.87,51.45 10.83,51.73 5.63,57.8 4.95,64.87 4.64,75.82 11.34,75.07 16.3,84.67 18.41,78.36 15.75,51.02 34.52,48.44 31.46,48.04 31.46,53.6 30.08,61.49 11.54,87.29 8.53,89.16 26.86,23.16
  pour Top: 38.64,100 0,100 0,0 38.64,0
  pour Bottom: 38.64,100 0,100 0,0 38.64,0
LC_0
  Top 0.4: IC4.23 21.39,60.46 arc90 21.98,60.46 22.61,61.09 arc-45 23.68,61.53 24.32,61.53 24.72,61.13 R21.2
LC_1
  Top 0.4: IC4.24 21.23,61.77 22.81,63.35 arc-45 24.16,63.91 24.4,63.67 R20.2
LC_2
  Top 0.4: IC4.25 22.24,64.38 arc-45 22.84,64.63 arc90 23.21,65 arc-45 23.28,65.18 23.61,65.5 R19.2
LR_0
  Top 0.4: IC4.26 22.34,65.61 | 1.K 34.77,95.43 arc-90 36.47,93.73 36.47,93.19 arc-45 36.03,92.13 arc45 35.35,90.51 35.35,87.48 arc45 35.63,86.82 35.84,86.6 arc-45 36.39,85.29 36.39,78.06 arc-45 35.65,76.27 33.37,74 | 33.37,72.09 33.37,68.84 5.K
  Top 0.406: 22.34,65.61 arc45 22.42,65.8 22.42,66.16 arc-45 22.68,66.8 28.9,73.02 arc-45 30.69,73.76 33.13,73.76 | 33.37,74 33.13,73.76 | 33.37,72.09 33.37,73.18 arc45 33.13,73.76
  Bottom 0.4: 5.K 33.37,68.84 34.59,68.84 arc-90 37.34,66.08 37.34,55.25 arc-45 36.34,52.84 33.41,49.9 arc45 32.66,48.09 32.66,43.64 arc-45 32.4,43.02 32.17,42.79 arc45 31.7,41.66 31.7,39.92 arc-45 30.88,37.93 30.33,37.38 arc-45 28.48,36.61 25.34,36.61 arc45 9.K
LR_1  (via drill 0.6)
  Top 0.4: 10.K 36.54,32.01 arc45 37.26,33.74 37.26,53.96 arc45 36.85,54.96 36.49,55.32 arc45 35.28,55.82 33.68,55.82 6.K
  Top 0.406: IC4.27 21.28,65.69 arc45 21.62,66.51 arc-45 21.92,67.23 28.52,73.83 arc-45 30.26,74.55 32.58,74.55 33.92,75.9 | 33.92,75.9 33.92,76.99 arc-45 34.22,77.7 arc90 34.22,78.94 33.95,79.21 arc-90 33.95,80.92 34.35,81.33 arc45 34.72,82.21 34.72,82.68 arc45 34.07,84.25 v33.69,84.63 | v32.1,86.22 30.34,87.98 arc45 28.45,88.76 2.K | 6.K 33.61,55.74 33.61,60.24 arc-45 34.13,61.5 36.84,64.21 arc45 37.34,65.41 37.34,67.04 arc45 36.8,68.34 36.55,68.59 arc-45 35.99,69.95 35.99,73.52 36.15,73.6 v36.31,73.76 | 33.92,75.9 34.24,76.22 v34,76.46
  Bottom 0.406: v33.69,84.63 v32.1,86.22 | v34,76.46 36.23,73.84 v36.31,73.76
LR_2  (via drill 0.6)
  Top 0.4: 7.K 24.39,50.65 arc45 24.88,51.83 24.88,54.7 arc45 24.42,55.8 24.32,55.89 arc-90 24.32,57.61 25.27,58.56 v25.35,58.56 | IC4.28 19.41,64.95 arc90 19.41,64.06 19.92,63.55 arc-45 20.19,62.9 v20.19,62.57 | 33.29,81.54 3.K
  Top 0.406: IC4.28 20.54,66.08 arc45 20.83,66.77 arc-45 21.17,67.59 28.21,74.63 arc-45 29.93,75.34 32.26,75.34 32.43,75.52 arc45 32.81,76.44 32.81,76.86 arc45 32.54,77.53 arc-45 32.18,78.39 32.18,79.12 arc-45 32.21,79.18 arc45 32.34,79.5 arc-45 33.1,81.35 33.29,81.54
  Bottom 0.4: 11.K 22.59,22.1 arc90 22.59,25.72 16.13,32.18 arc-45 15.63,33.39 15.63,33.6 arc-90 17.45,35.42 arc90 18.76,36.74 18.76,37.05 arc-90 20.23,38.52 20.99,38.52 arc45 23.83,39.69 arc45 24.96,42.41 24.96,44.88 arc-45 25.31,45.74 arc45 25.67,46.6 25.67,46.88 arc90 23.96,48.6 22.67,48.6 7.K | v20.19,62.57 20.93,61.83 arc45 21.64,61.53 21.71,61.53 arc-45 22.84,61.06 v25.35,58.56
LR_3  (via drill 0.6)
  Top 0.4: v26.62,76.3 24.44,76.3 arc45 22.61,75.54 4.K | 33.21,23.12 31.45,21.35 arc45 30.75,19.67 30.75,19.35 arc90 31.59,18.51 arc-45 32.05,18.32 33.07,17.3 arc-45 33.29,16.76
  Top 0.406: v11.22,58.68 11.3,58.93 arc-28 11.57,59.37 IC4.11 | 33.21,23.12 35.19,25.09 arc-45 35.59,25.26 arc45 36,25.43 36.42,25.85 arc45 36.7,26.53 v36.7,29.39 | v34.56,33.12 34.32,33.36 34.32,38.47 arc45 34.06,39.09 33.87,39.29 arc-45 33.29,40.67 8.K | 33.29,16.76 12.K
  Bottom 0.4: v26.62,76.3 28.16,74.76 arc45 31.73,73.28 31.84,73.28 arc-45 34.18,72.31 36.77,69.72 arc-45 38.05,66.63 38.05,54.51 arc-45 37.33,52.74 33.93,49.32 arc45 33.45,48.15 33.45,42.92 33.29,42.8 8.K | 17.97,66.3 18.17,66.1 arc-45 18.76,64.66 18.76,63.35 arc-45 18.21,62.01 16.09,59.89 arc-45 13.15,58.68 12.65,58.68
  Bottom 0.406: 4.K 22.02,74.95 17.1,74.95 arc45 16.28,74.61 15.24,73.56 arc45 14.8,72.5 14.8,71.57 arc-45 14.49,70.83 14.33,70.67 arc45 13.92,69.69 13.92,69.62 arc90 16.85,66.69 17.14,66.69 arc-45 17.88,66.39 17.97,66.3 | 12.65,58.68 v11.22,58.68 | v36.7,29.39 35.26,31.15 arc-39 v34.56,33.12
MISO  (via drill 0.6)
  Top 0.4: IC4.16 15.95,58.09 arc45 16.22,58.76 16.22,59.76 arc-45 16.41,60.21 arc45 16.54,60.53 16.54,60.91 arc-45 16.84,61.63 17.3,62.09 arc90 v17.3,62.6 | IC5.6 11.38,78.61 arc45 11.9,77.37 12.83,76.44 arc-45 12.93,76.19 arc45 13.02,75.97 13.26,75.73 arc-45 13.49,75.18 13.49,74.51 arc-45 13.21,73.83 v12.81,73.44
  Top 0.406: IC4.16 15.34,57.55 15.11,57.33 15.25,57.19 arc-45 15.43,56.76 15.43,56.65 arc90 16.1,55.98 arc-45 16.58,55.78 17.64,54.72 arc-45 17.81,54.31 arc45 17.98,53.9 18.5,53.38 arc45 19.71,52.88 21.09,52.88 arc45 ISP1.1
  Bottom 0.4: v12.81,73.44 12.74,71.88 arc-28 12.63,71.53 12.57,71.43 arc31 12.49,71.14 12.49,68.76 arc38 13.17,66.69 arc46 15.67,65.26 arc-44 16.18,64.99 arc5 16.61,64.52 17.03,64.1 arc-45 17.3,63.46 v17.3,62.6
MOSI  (via drill 0.6)
  Top 0.4: ISP1.4 21.7,56.69 21.7,54.95 21.66,54.95 20.69,53.97 arc-90 19.02,53.97 18.78,54.22 | IC4.15 15.28,58.55 arc45 15.51,59.11 15.51,60.08 arc-45 15.64,60.39 arc45 15.83,60.85 15.83,61.34 arc-45 16.05,61.87 arc45 16.3,62.49 16.3,63.05 arc45 v16.14,63.44 | IC5.5 10.11,79.12 arc45 10.87,77.28 12.06,76.1 arc45 12.17,75.83 12.53,75.46 arc-45 12.73,74.98 arc-45 12.56,74.58 11.99,74.01 arc45 11.78,73.5 v11.78,72.25
  Top 0.406: 18.78,54.22 arc-45 18.61,54.63 arc45 18.44,55.03 v16.46,57.01 | IC4.15 14.41,57.68 arc90 14.41,56.76 14.54,56.63 arc-45 14.64,56.4 14.64,56.36 arc90 15.73,55.26 arc-45 16.16,55.08 16.69,54.56 arc-45 17.02,53.76 17.02,52.96 | 17.02,52.96 17.29,52.96 arc-45 18.18,52.59 arc45 19.2,52.17 20.09,52.17 arc-23 20.9,52 21.31,51.83 arc68 22.65,52.08 arc90 22.65,54 21.7,54.95 | IC6.4 14.64,50.9 14.64,51.19 arc-90 15.54,52.09 15.74,52.09 arc45 16.43,52.38 17.02,52.96
  Bottom 0.4: v11.78,72.25 11.78,68.2 arc45 12.79,65.76 13.64,64.91 arc45 14.51,64.55 15.09,64.55 arc-45 15.87,64.23 arc-45 16.14,63.57 v16.14,63.44
N$1
  Top 0.4: Q1.2 3.01,68.48 3.13,68.36 7.13,68.36 C1.1 7.48,68.61 7.89,68.2 8.12,68.2 arc-90 8.76,67.55 8.76,66.39 arc90 10.45,64.71 11.29,64.71 arc-45 11.63,64.56 IC4.7
N$2
  Top 0.4: IC4.8 11.22,63.84 11.22,63.91 10.73,63.42 arc-45 8.85,62.64 7.89,62.64 7.48,62.24 C2.1 6.99,61.85 3.45,61.85 3.01,61.41 Q1.1
N$3  (1 unrouted)
  Top 0.4: IC6.8 9.44,47.09 9.48,47.05 arc45 9.81,46.23 10.09,45.96 arc45 10.53,45.78 arc-90 11.06,45.24 11.06,42.67 arc-90 10.56,42.17 10.27,42.17 10.19,42.25 9.68,42.25
N$4  (via drill 0.6)  (2 unrouted)
  Top 0.4: 9.6,45.21 arc45 9.43,45.63 9.16,45.9 arc45 8.78,46.06 8.32,46.06 arc-45 7.72,46.3 7.54,46.48 arc45 7.04,46.69 5.72,46.69 arc90 5.27,46.24 5.27,45.2 arc-90 3.94,43.87 arc45 3.5,43.69 3.29,43.48 arc45 2.93,42.61 arc-90 2.09,41.77 v1.54,41.77 | v1.78,28.99 2.56,28.99 arc-90 4.08,27.47 R1.1
  Bottom 0.4: v1.78,28.99 1.7,29.15 1.59,29.32 arc-32 1.3,30.33 1.3,41.53 v1.54,41.77
N$5
  Top 0.4: GLIDE.P$1 11.66,26.25 10.78,25.37 arc-45 9.93,25.02 6.21,25.02 arc-45 5.55,25.29 5.5,25.34 arc45 4.75,25.66 4.24,25.66 R1.2
N$6  (1 unrouted)
  Top 0.4: GLIDE.P$2 GLIDE.P$3 6.62,26.56 6.62,26.74 arc37 6.17,28.07 5.1,29.47 arc-37 4.79,30.36 4.79,30.59 arc-90 5.65,31.45 5.76,31.45 arc90 7.33,33.03 7.33,33.36 7.68,33.7 C3.1 7.68,34.02 7.97,34.39 arc-90 9.56,35.97 10.1,35.97 arc45 10.93,36.32 11.03,36.41 arc45 11.3,37.08 11.3,38.8 arc90 10.48,39.63
N$7
  Top 0.4: R3.1 1.23,34.86 0.91,35.18 0.91,35.6 arc45 0.81,35.84 arc-45 0.51,36.55 0.51,42.47 arc-45 0.69,42.9 arc45 0.91,43.42 0.91,44.39 TR1.1 1.25,44.28 1.58,43.95 2.04,43.95 arc45 3.01,44.36 3.03,44.37 arc-45 3.65,44.63 arc90 4.52,45.5 4.52,46.58 arc-45 4.68,46.98 arc90 4.68,47.6 4.33,47.95 arc-45 4.2,48.27 4.2,48.4 4,48.6 4,49.36 TR1.2
N$8
  Top 0.4: R3.2 R4.2 | 1.22,30.57 R4.2 | CV_OUT.TIP 3.18,13.52 arc-90 0.51,16.19 0.51,28.93 arc-45 0.83,29.71 0.85,29.73 arc45 0.98,30.05 0.98,30.1 1.38,30.5 R4.2
N$9
  Top 1.016: JP1.10 JP1.9 25.16,2.67 D1.A
N$10
  Top 1.016: JP1.2 JP1.1 14.08,3.27 D2.C
N$11  (1 unrouted)
  Top 0.4: 8.86,37.09 arc45 8.29,36.85 8.19,36.75 arc-45 7.47,36.45 7.14,36.45 C6.1 6.43,35.74 4.59,35.74 arc90 2.81,33.96 2.81,32.41 arc45 2.87,32.26 arc-45 2.97,32.03 2.97,31.29 3.28,30.98 R4.1
N$12  (1 unrouted)
  Top 0.4: 4.08,38.35 R2.2 | 7.05,38.36 C6.2 4.44,38.09 R2.2 | TR1.3 6.33,44.14 5.87,43.67 5.79,43.67 arc45 5.24,43.45 arc-45 4.54,43.16 4.33,43.16 arc90 3.68,42.51 3.68,42.04 arc-90 2.42,40.78 arc90 1.22,39.58 1.22,37.4 arc90 2.21,36.41 3.05,36.41 arc90 4.04,37.4 4.04,37.68 R2.2
N$13  (1 unrouted)
  Top 0.4: C8.1 19.84,39.1 19.48,39.47 | C8.1 20.23,38.83 R6.1 22.66,38.63 arc90 24.08,37.2 24.27,37.2 arc-45 25.03,36.89 R7.2 | 19.79,34.54 C7.1 19.88,34.45 19.88,34.86 19.32,35.42 19.32,37.41 arc-45 19.6,38.08 arc45 19.95,38.94 C8.1 | 15.66,43.44 arc-45 16.76,42.98 17.7,42.04 arc45 18.26,41.81 arc-90 18.68,41.39 18.68,39.92 arc90 19.14,39.47 19.48,39.47 | 19.67,39.39 C8.1 | 19.48,39.47 19.59,39.47 C8.1
N$14
  Top 0.4: R5.1 7.73,73.9 arc45 LED1.K
N$15  (via drill 0.6)
  Top 0.4: R6.2 R8.2 24.56,42.05 arc45 24.08,43.2 v23.92,43.36 | v6.3,48.04 arc-90 4.79,49.55 4.79,51.21 4.16,51.85 TRIG_OUT.TIP
  Bottom 0.4: v23.92,43.36 23.63,43.36 arc45 22.74,42.99 22.22,42.47 arc-90 16.84,42.47 16.28,43.03 arc45 14.9,43.59 11.99,43.59 arc-45 9.87,44.47 v6.3,48.04
N$16  (1 unrouted)
  Top 0.4: 19.48,41.58 C8.2 | R8.1 20.23,41.37 C8.2 | 15.61,44.71 arc-45 16.39,44.39 18.08,42.69 arc45 18.58,42.48 19.01,42.48 arc-90 19.95,41.54 C8.2
N$17  (1 unrouted)
  Top 0.4: 15.31,38.36 arc-90 15.99,37.68 15.99,35.27 arc-45 15.81,34.85 arc45 15.67,34.5 15.67,30.31 C9.1 15.82,30.05 R10.2 R9.1
N$18  (via drill 0.6)
  Top 0.4: R9.2 12.03,24.94 arc45 11.2,24.6 10.98,24.38 arc-45 10.42,24.15 3.56,24.15 arc-90 2.49,25.21 2.49,26.61 arc90 v1.62,27.48
  Bottom 0.4: v1.62,27.48 1.17,27.8 arc-54 0.51,29.09 0.51,88.24 arc-45 1.66,91.02 CV_IN.TIP
N$19  (2 unrouted)
  Top 0.4: 3.49,80.89 arc-90 5.55,82.96 7.77,82.96 arc45 8.11,83.11 arc-90 9.26,83.11 9.46,82.9 arc45 10.08,82.65 10.97,82.65 arc90 12.65,84.33 IC5.2 | 3.49,79.43 3.45,79.39 2.88,79.39 arc90 1.54,78.05 1.54,77.45 R12.1
N$20  (1 unrouted)
  Top 0.4: R11.1 R12.2 3.64,77.65 3.71,77.65 arc90 4.75,78.69
N$21  (via drill 0.6)  (1 unrouted)
  Top 0.4: 14.95,37.09 14.88,37.01 arc-90 13.53,35.66 arc90 11.54,33.67 11.54,32.48 arc90 13.45,30.58 13.88,30.15 C9.2 13.93,30.05 R10.1 13.81,27.4 arc-45 12.78,27.83 12.74,27.87 arc45 12.34,28.04 9.04,28.04 arc-53 6.82,29.14 v5.91,30.34 | R11.2 1.27,74.41 arc-45 0.89,73.5 arc45 0.51,72.59 0.51,49.54 arc45 1.29,47.66 v1.62,47.33
  Bottom 0.4: v1.62,47.33 1.62,43.96 arc45 2.05,42.93 2.55,42.42 arc-90 2.55,40.96 arc45 2.1,39.85 2.1,32.51 arc90 4.26,30.34 v5.91,30.34
N$22
  Top 0.4: 1.2 1.1 27.87,93.44 28.92,93.44 arc-45 30.55,92.77 33.25,90.07 arc-45 33.81,88.73 D3.A
N$23  (2 unrouted)
  Top 0.4: 4.75,87.97 R13.1 | IC5.3 11.38,84.2 arc-90 10.62,83.44 10.26,83.44 arc-45 9.6,83.71 9.53,83.79 arc90 7.84,83.79 arc-45 7.58,83.68 5.36,83.68 arc-90 4.71,84.33 4.71,85.29
N$24  (1 unrouted)
  Top 0.4: 6.03,87.97 R13.2 R14.1
N$25
  Top 0.4: R14.2 arc-90 1.7,93.41 1.7,94.79 JP2.2
N$26
  Top 0.4: 2.1 17,87.19 D4.A 20.25,90.44 2.2
N$27
  Top 0.4: 3.2 31.38,83.27 arc-45 30.75,81.73 D5.A 30.24,81.41 arc90 28.95,81.41 27.79,80.25 3.1
N$28
  Top 0.4: D6.A 19.2,74.75 | 19.2,74.75 19.2,75.13 arc-45 19.62,76.14 4.2 | 4.1 17.81,74.33 arc-45 18.82,74.75 19.2,74.75
N$29
  Top 0.4: 5.1 27.94,66.85 D7.A 31.38,70.3 5.2
N$30
  Top 0.4: D8.A 27.18,48.44 arc-45 27.28,48.7 arc45 27.42,49.02 27.42,52.61 arc-45 6.1
  Bottom 0.4: 6.1 6.2
N$31
  Top 0.4: 7.2 18.84,48.7 D9.A 18.82,48.68 7.1
N$32
  Top 0.4: D10.A 29.76,40.19 8.1
  Bottom 0.4: 8.2 8.1
N$33
  Top 0.4: 9.2 22.69,36.81 arc-42 23.77,36.21 arc5 25.47,34.35 25.75,34.07 arc-45 26.09,33.24 D11.A
  Bottom 0.4: 9.1 17.46,33.52 20.59,36.65 9.2
N$34
  Top 0.4: 28.14,27.2 10.1 | D12.A 29.91,29.67 arc45 31.1,30.16 10.2
  Top 0.406: D12.A 28.93,29.11 arc-45 28.14,27.2
N$35
  Top 0.4: 11.1 17.3,20.19 D13.A 20.59,23.48 11.2
N$36
  Top 0.4: 12.1 28.69,13.52 arc45 30.51,14.27 D14.A 30.86,14.62 arc45 31.38,15.89 12.2
N$37  (via drill 0.6)
  Top 0.4: 22.89,86.14 23.16,85.87 arc-45 23.69,84.61 23.69,80.58 | 23.69,80.58 23.69,80.42 25.42,78.69 arc45 27.94,77.65 28.14,77.65 arc45 29.35,78.15 3.A | 20.35,80.42 23.53,80.42 23.69,80.58 | 2.A 18.68,84.05 arc45 20.06,80.72 20.35,80.42 | 4.A 20.5,73.42 arc45 20.91,74.42 20.91,75.16 arc-45 21.23,75.95 21.68,76.4 arc90 21.68,78.02 20.73,78.98 arc-45 20.27,80.08 20.27,80.35 20.35,80.42
  Top 0.406: R19.1 25.58,66.45 arc33 25.27,67.01 v24.96,67.33 | 22.89,86.14 21.5,87.53 arc-90 21.5,89.51 22.74,90.75 arc-45 24.81,91.61 1.A
  Bottom 0.406: v24.96,67.33 24.8,67.72 21.55,70.97 arc45 20.57,71.38 19.25,71.38 arc-45 4.A
N$38  (via drill 0.6)
  Top 0.4: R20.1 27.97,63.44 | 27.97,63.44 5.A | 6.A 29.48,53.06 arc45 28.93,54.39 arc-45 28.69,54.97 28.69,61.98 arc45 28.16,63.25 27.97,63.44 | 8.A arc-45 29.81,39.08 31.41,40.69 arc90 31.41,41.42 30.99,41.84 arc45 30.41,42.09 29.33,42.09 arc-90 27.97,43.44 27.97,44.1 arc-45 28.34,45 v28.37,45.02 | 7.A 20.59,44.94 arc-45 21.4,44.61 21.65,44.36 arc94 23.27,44.41 arc-49 23.92,44.71 v25.99,44.71
  Bottom 0.4: v28.37,45.02 27.97,44.71 v25.99,44.71 25.99,44.77 arc-45 26.28,45.48 arc45 26.54,46.11 26.54,47.85 arc-45 27.13,49.26 6.A
N$39  (via drill 0.6)
  Top 0.4: 12.A arc-45 28.32,11.13 22.47,11.13 arc-90 21.54,12.06 21.54,13.1 arc45 21.14,14.07 19.57,15.64 arc-45 18.68,17.79 11.A arc45 17.73,18.67 16.89,18.67 arc-45 16.02,19.03 arc-97 16.16,21.43 17.7,22.63 arc32 18.43,23.65 18.68,24.32 | R21.1 26.85,61.06 arc-90 27.89,60.02 27.89,56.25 arc-45 27.36,54.97 26.88,54.49 arc45 26.54,53.68 26.54,49.42 arc-45 26.35,48.96 arc45 26.07,48.27 26.07,47.87 arc90 26.69,47.25 27.56,47.25 arc45 27.99,47.42 28.37,47.8 arc-90 30.11,47.8 30.74,47.17 arc-45 v31.31,45.82 | 20.27,27.4 19.58,28.09 arc-45 18.68,30.26 9.A
  Top 0.406: 10.A 26.2,24.94 arc-45 v24.48,25.66 | v22.73,27.4 20.27,27.4 19.73,26.87 arc45 18.68,24.32
  Bottom 0.4: v31.31,45.82 arc45 30.9,45.65 19.82,34.57 arc45 19.32,33.36 19.32,32.82 arc-45 18.91,31.84 9.A
  Bottom 0.406: v24.48,25.66 v22.73,27.4
RST  (via drill 0.6)
  Top 0.4: IC4.29 18.78,65.45 arc45 18.53,64.83 18.53,64.29 arc45 18.79,63.65 18.91,63.53 arc-45 19.16,62.93 19.16,62.37 arc-45 18.85,61.62 arc37 18.46,60.84 v18.45,60.74
  Bottom 0.4: ISP1.5 24.15,56.72 arc-45 23.04,57.18 22.54,57.68 arc45 21.85,57.96 arc-45 20.1,58.69 18.61,60.18 v18.45,60.74
SCK  (via drill 0.6)
  Top 0.4: IC5.7 12.65,78.5 arc45 13.15,77.31 13.56,76.9 arc-45 13.72,76.5 arc45 13.84,76.22 13.97,76.09 arc-45 14.24,75.43 14.24,73 arc-45 v13.76,71.85 | v17.49,65.11 arc-45 17.81,64.34 17.81,64.04 arc45 18.13,63.28 arc-90 18.13,61.93 17.59,61.4 arc45 17.26,60.58 v17.26,59.63 17.1,59.63 16.94,59.47 | IC6.3 12.77,49.63 arc45 v12.29,49.43
  Top 0.406: IC4.17 17.12,57.95 arc-45 16.94,58.39 16.94,59.47
  Bottom 0.4: v13.76,71.85 13.76,71.71 arc-45 13.59,71.28 arc45 13.21,70.37 13.21,69.3 arc90 16.53,65.98 16.62,65.98 arc-90 v17.49,65.11 | ISP1.3 22.63,54.92 arc-45 21.02,55.59 17.26,59.35 v17.26,59.63
  Bottom 0.406: 17.26,59.55 v17.26,59.63 15.06,57.49 arc46 14.08,55.16 14.08,52.69 arc-45 13.55,51.39 12.73,50.58 arc48 v12.29,49.43
TRIG  (via drill 0.6)  (1 unrouted)
  Top 0.4: IC4.12 13.78,60.45 arc45 14.12,61.27 v14.12,61.33 | 11.3,53.16 11.62,52.52 11.85,52.13 arc-41 11.9,51.79 11.86,51.57 11.86,51.36 arc-60 11.6,50.92 11.42,50.82 10.96,50.43 arc50 10.67,49.8 10.67,49.15 arc44 10.95,48.47 12.34,47.05 arc-44 12.49,46.67 12.49,46.46 arc45 12.64,46.11 arc-45 12.93,45.41 12.93,42.71 arc90 13.47,42.17
  Top 0.406: IC4.12 12.53,59.2 arc45 12.26,58.53 12.26,58.45 arc-45 12.02,57.89 11.81,57.67 arc46 11.24,56.26 11.3,53.16
  Bottom 0.4: 13.13,63.36 14.12,62.37 v14.12,61.33
  Bottom 0.406: 13.13,63.36 11.02,65.47 arc-45 10.35,67.09 10.35,68.42 arc45 10.06,69.13 arc-45 9.72,69.96 9.72,70.57 arc-45 10.12,71.54 arc45 10.43,72.3 LED1.A

### Text on the board
tPlace: TR1 | Pure Quat V2.1 | -12V | POWER
bPlace: C | C# | D | D# | E | F | Pure Quat V2.1 | F# | SLEW | G | G# | A | A# | B | copyright GMSN Ltd 2016